# Altium project ForceVerkada.PrjPcb
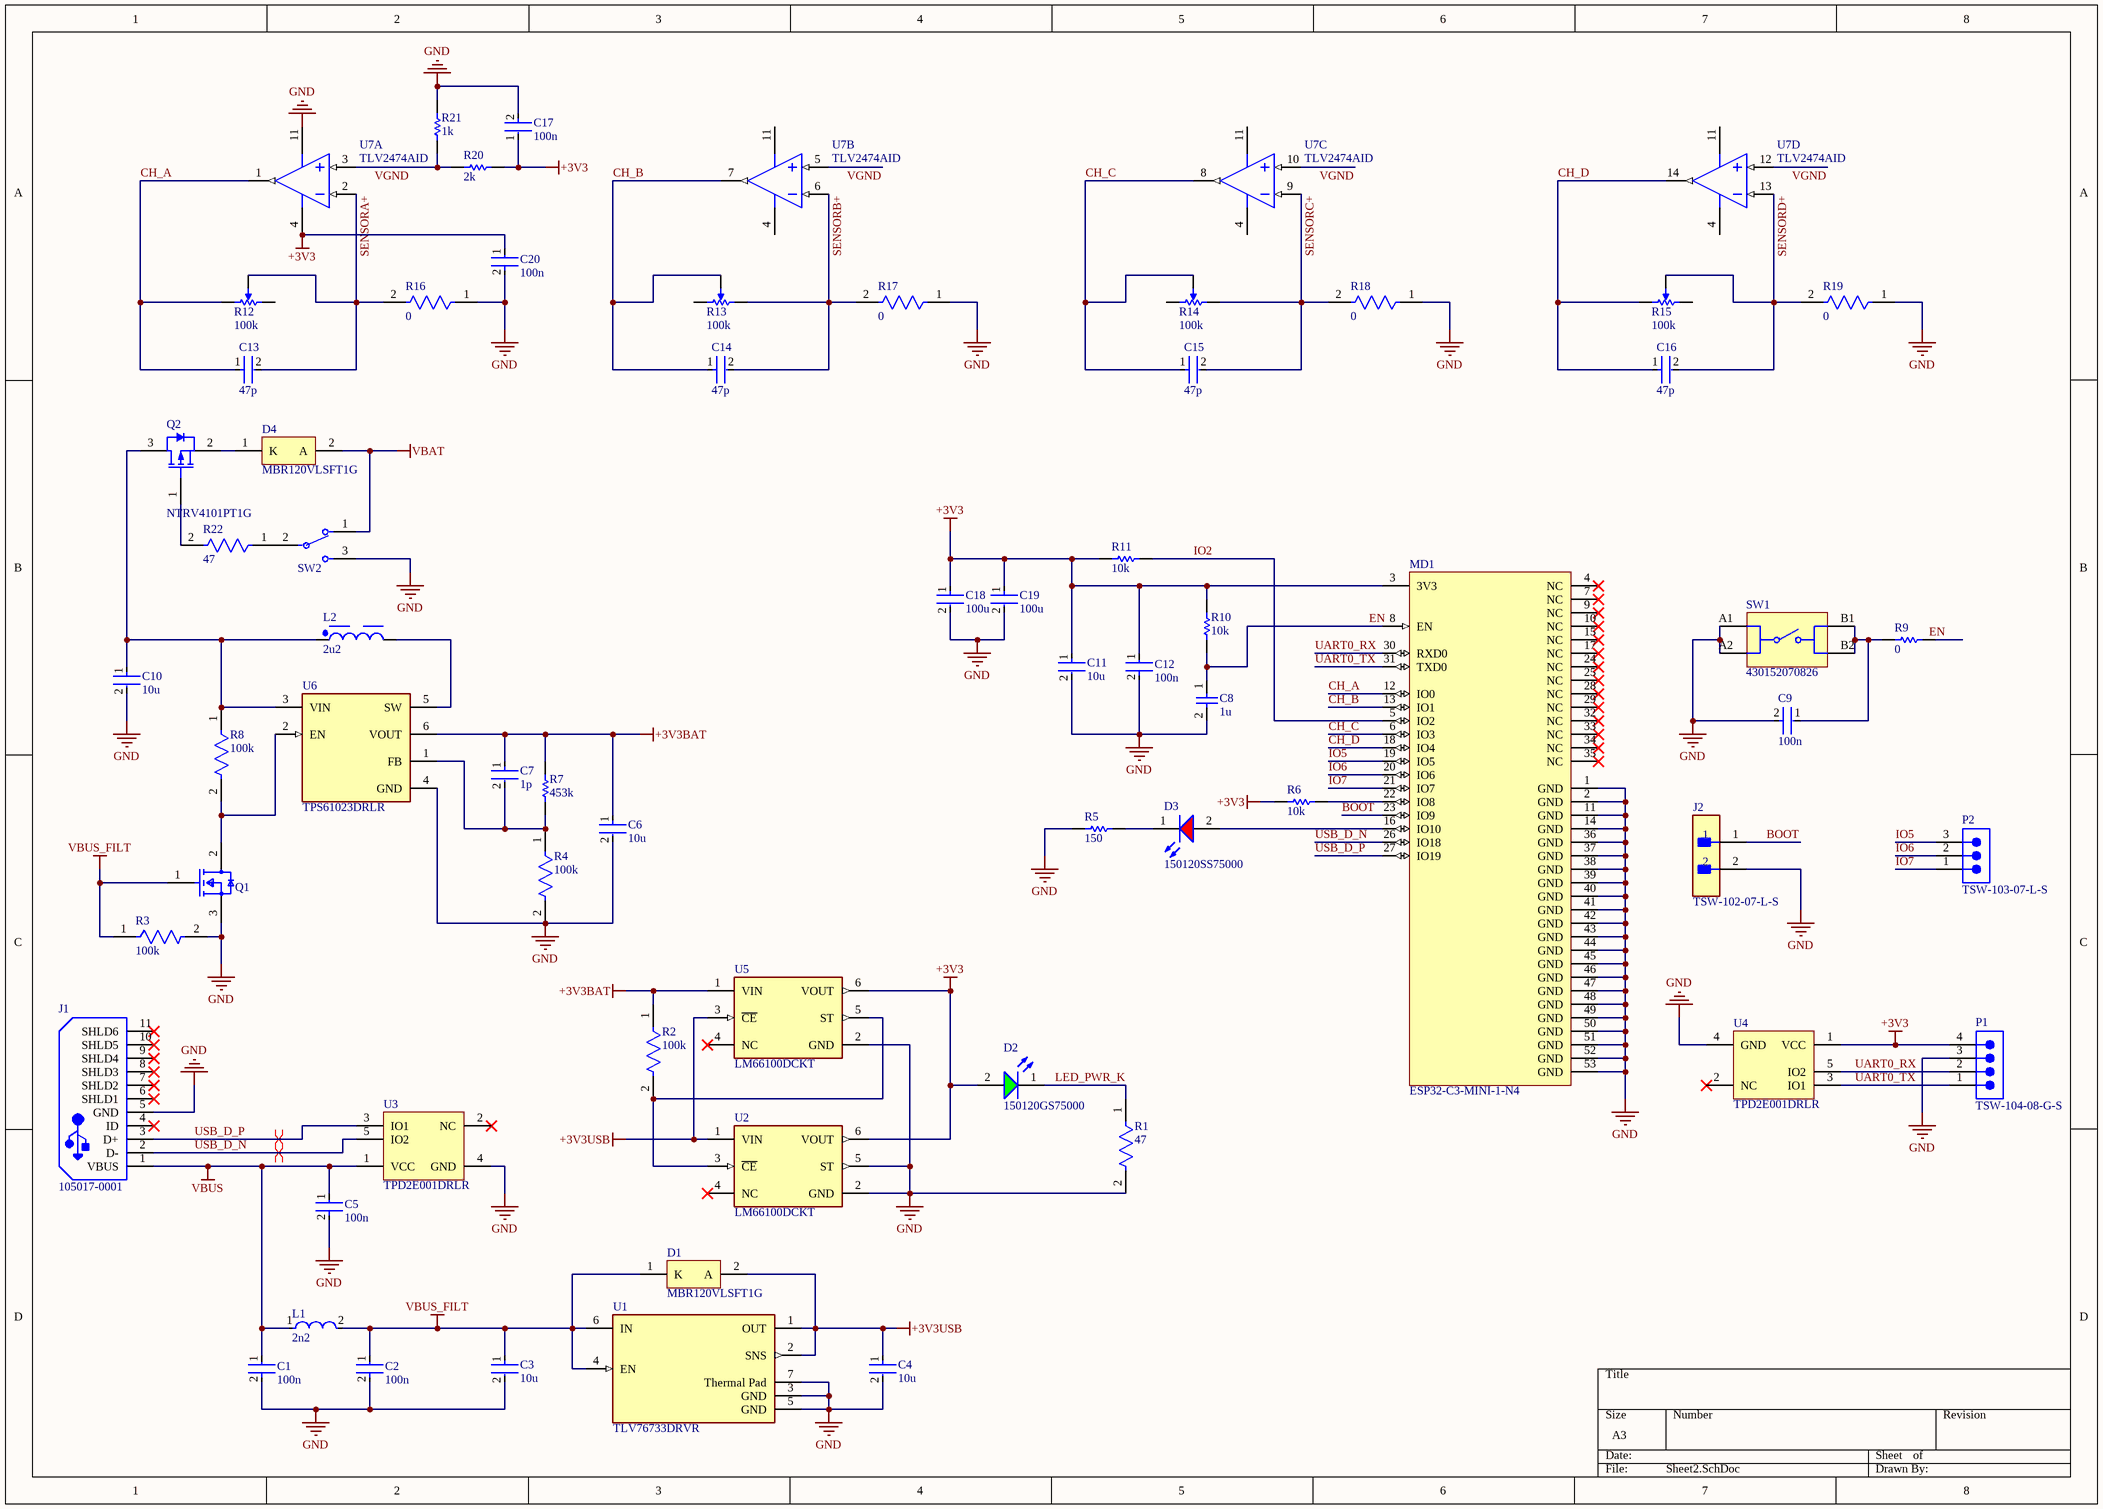
[diagram p0: Sheet2.SchDoc]
1 sheet, 64 parts. Net scope: global (net labels, ports and power ports of the same name join across sheets).
Board file: PCB2.PcbDoc

## Sheet Sheet2.SchDoc
size A3; SheetNumber: 1; SheetTotal: 1

### Parts
C1  100n  [FP-GRM15-MFG]
C2  100n  [FP-GRM15-MFG]
C3  10u  [FP-CL21-IPC_C]
C4  10u  [FP-CL21-IPC_C]
C5  100n  [FP-GRM15-MFG]
C6  10u  [FP-CL21-IPC_C]
C7  1p  [FP-GJM155-0_05-IPC_B]
C8  1u  [CAPC2013X135X45LL10T25]
C9  100n  [FP-GRM15-MFG]
C10  10u  [FP-GRM21B-0_1-IPC_C]
C11  10u  [FP-GRM21B-0_1-IPC_C]
C12  100n  [FP-GRM15-MFG]
C13  47p  [FP-C0805C-DN-MFG]
C14  47p  [FP-C0805C-DN-MFG]
C15  47p  [FP-C0805C-DN-MFG]
C16  47p  [FP-C0805C-DN-MFG]
C17  100n  [FP-GRM15-MFG]
C18  100u  [FP-CL32-IPC_C]
C19  100u  [FP-CL32-IPC_C]
C20  100n  [FP-GRM15-MFG]
D1  MBR120VLSFT1G  [ONSC-SOD-123FL-2-498-01_V]
D2  150120GS75000  [WL-SMCW_1206_150120xx75000]
D3  150120SS75000  [WL-SMCW_1206_150120xx75000]
D4  MBR120VLSFT1G  [ONSC-SOD-123FL-2-498-01_V]
J1  105017-0001  [USB-MICRO-B_V]
J2  TSW-102-07-L-S  [FP-TSW-102-07-L-S-MFG]
L1  2n2  [FP-LQW15AN_80-MFG]
L2  2u2  [WE-PD_7332R]
MD1  ESP32-C3-MINI-1-N4  [FP-ESP32-C3-MINI-1-N4-MFG]
P1  TSW-104-08-G-S  [SMTC-TSW-104-08-X-S]
P2  TSW-103-07-L-S  [SMTC-TSW-103-07-X-S]
Q1  FDN337N  [FP-527AG-MFG]  (value not drawn)
Q2  NTRV4101PT1G  [ONSC-SOT-23-3-318-08_V]
R1  47  [FP-RC0603-0_55-MFG]
R2  100k  [FP-RC0805-0_6-IPC_C]
R3  100k  [FP-RC0805-0_6-IPC_C]
R4  100k  [FP-RC0805-0_6-IPC_C]
R5  150  [RESC1608X55X25ML10T15]
R6  10k  [RESC2013X60X35NL10T20]
R7  453k  [RESC2013X60X35NL10T20]
R8  100k  [FP-RC0805-0_6-IPC_C]
R9  0  [RESC2013X60X35ML10T20]
R10  10k  [RESC2013X60X35NL10T20]
R11  10k  [RESC2013X60X35NL10T20]
R12  100k  [BOUR-3214W_V]
R13  100k  [BOUR-3214W_V]
R14  100k  [BOUR-3214W_V]
R15  100k  [BOUR-3214W_V]
R16  0  [FP-RC2512-0_65-IPC_C]
R17  0  [FP-RC2512-0_65-IPC_C]
R18  0  [FP-RC2512-0_65-IPC_C]
R19  0  [FP-RC2512-0_65-IPC_C]
R20  2k  [RESC2013X60X35ML10T20]
R21  1k  [RESC2013X60X35ML10T20]
R22  47  [FP-RC0603-0_55-MFG]
SW1  430152070826  [430152070826]
SW2  JS102011SAQN  [FP-JS102011SAQN-MFG]  (value not drawn)
U1  TLV76733DRVR  [FP-DRV0006A-IPC_C]
U2  LM66100DCKT  [FP-DCK0006A-IPC_C]
U3  TPD2E001DRLR  [DRL0005A_L]
U4  TPD2E001DRLR  [DRL0005A_L]
U5  LM66100DCKT  [FP-DCK0006A-IPC_C]
U6  TPS61023DRLR  [FP-DRL0006A-MFG]
U7  TLV2474AID  [D0014A_N]  (parts A,B,C,D of 4)

### Nets
+3V3: C11.1 C12.1 C17.1 C18.1 C19.1 C20.1 D2.2(A) MD1.3(3V3) P1.4 R6.1 R10.2 R11.1 R20.2 U2.6(VOUT) U4.1(VCC) U5.6(VOUT) U7.4(VDD)
+3V3BAT: C6.1 C7.1 R2.1 R7.2 U5.1(VIN) U6.6(VOUT)
+3V3USB: C4.1 D1.2(A) U1.1(OUT) U1.2(SNS) U2.1(VIN) U5.3(~{CE})
GND: C1.2 C2.2 C3.2 C4.2 C5.2 C6.2 C8.2 C9.2 C10.2 C11.2 C12.2 C17.2 C18.2 C19.2 C20.2 J1.5(GND) J2.2 MD1.1(GND) MD1.2(GND) MD1.11(GND) MD1.14(GND) MD1.36(GND) MD1.37(GND) MD1.38(GND) MD1.39(GND) MD1.40(GND) MD1.41(GND) MD1.42(GND) MD1.43(GND) MD1.44(GND) MD1.45(GND) MD1.46(GND) MD1.47(GND) MD1.48(GND) MD1.49(GND) MD1.50(GND) MD1.51(GND) MD1.52(GND) MD1.53(GND) P1.3 Q1.3(S) R1.2 R3.2 R4.2 R5.1 R16.1 R17.1 R18.1 R19.1 R21.2 SW1.A1 SW1.A2 SW2.3 U1.3(GND) U1.5(GND) U1.7(Thermal_Pad) U2.2(GND) U2.5(ST) U3.4(GND) U4.4(GND) U5.2(GND) U6.4(GND) U7.11(GND)
VBAT: D4.2(A) SW2.1
VBUS: C1.1 C5.1 J1.1(VBUS) L1.1 U3.1(VCC)
VBUS_FILT: C2.1 C3.1 D1.1(K) L1.2 Q1.1(G) R3.1 U1.4(EN) U1.6(IN)
BOOT: J2.1 MD1.23(IO9)
CH_A: C13.1 MD1.12(IO0) R12.3 U7.1(OUT1)
CH_B: C14.1 MD1.13(IO1) R13.2 U7.7(OUT2)
CH_C: C15.1 MD1.6(IO3) R14.2 U7.8(OUT3)
CH_D: C16.1 MD1.18(IO4) R15.3 U7.14(OUT4)
EN: C8.1 MD1.8(EN) R9.2 R10.1
IO2: MD1.5(IO2) R11.2
IO5: MD1.19(IO5) P2.3
IO6: MD1.20(IO6) P2.2
IO7: MD1.21(IO7) P2.1
LED_PWR_K: D2.1(K) R1.1
SENSORA+: C13.2 R12.2 R16.2 U7.2(IN1-)
SENSORB+: C14.2 R13.1 R17.2 U7.6(IN2-)
SENSORC+: C15.2 R14.1 R18.2 U7.9(IN3-)
SENSORD+: C16.2 R15.2 R19.2 U7.13(IN4-)
UART0_RX: MD1.30(RXD0) P1.2 U4.5(IO2)
UART0_TX: MD1.31(TXD0) P1.1 U4.3(IO1)
USB_D_N: J1.2(D-) MD1.26(IO18) U3.5(IO2)
USB_D_P: J1.3(D+) MD1.27(IO19) U3.3(IO1)
VGND: R20.1 R21.1 U7.3(IN1+) U7.5(IN2+) U7.10(IN3+) U7.12(IN4+)
NetC7_2: C7.2 R4.1 R7.1 U6.1(FB)
NetC9_1: C9.1 R9.1 SW1.B1 SW1.B2
NetC10_1: C10.1 L2.1 Q2.3(D) R8.1 U6.3(VIN)
NetD3_1: D3.1(K) R5.2
NetD3_2: D3.2(A) MD1.16(IO10)
NetD4_1: D4.1(K) Q2.2(S)
NetL2_2: L2.2 U6.5(SW)
NetMD1_22: MD1.22(IO8) R6.2
NetQ1_2: Q1.2(D) R8.2 U6.2(EN)
NetQ2_1: Q2.1(G) R22.2
NetR2_2: R2.2 U2.3(~{CE}) U5.5(ST)
NetR22_1: R22.1 SW2.2(C)

Not connected (* = marked no-connect by the designer): J1 4(ID)* 6(SHLD1)* 7(SHLD2)* 8(SHLD3)* 9(SHLD4)* 10(SHLD5)* 11(SHLD6)*; MD1 4(NC)* 7(NC)* 9(NC)* 10(NC)* 15(NC)* 17(NC)* 24(NC)* 25(NC)* 28(NC)* 29(NC)* 32(NC)* 33(NC)* 34(NC)* 35(NC)*; R12 1; R13 3; R14 3; R15 1; U2 4(NC)*; U3 2(NC)*; U4 2(NC)*; U5 4(NC)*

### Layout directives
differential pair: USB_D_N, USB_D_P

### Library data of the parts
C1 C2 C5 C9 C12 C17 C20 = CMP-2100-03641-2: CAP CER 0.1UF 16V X7R 0402; Manufacturer Part Number: GRM155R71C104KA88D; Manufacturer: Murata; Standoff Height: 0mm; Tolerance: 10%; Voltage Rating: 16Vdc; Material: Ceramic; Capacitance: 0.10μF; Value: 0.10μF; RoHS: TRUE; Temperature Characteristic: X7R; Octopart: https://octopart.com/grm155r71c104ka88d-murata-196880; Digikey Description: CAP CER 0.1UF 16V X7R 0402; Device Class L3: Ceramic Capacitors; Height: 0.55mm; ComponentLink2Description: Datasheet; Temperature Range Low: -55°C; Ipc Land Pattern Name: CAPC10050X219; ComponentLink2URL: https://search.murata.co.jp/Ceramy/image/img/A01X/G101/ENG/GRM155R71H471KA01-01A.pdf; Device Class L1: Passive Components; Lead Free: yes; Category: Cap; Package: GRM15; Temperature: -55°C to +125°C; Device Class L2: Capacitors; Temperature Range High: +125°C; Mouser Description: 0402 0.1 uF 16V ±10 % Tolerance X7R SMT Multilayer Ceramic Capacitor
C3 C4 C6 = CMP-13271-002245-1: CL21 Series 0805 10uF 10V ±20% Tolerance X5R Multilayer Ceramic Chip Capacitor; Voltage Rating (DC): 10V; Mount: Surface Mount; Tolerance: 20%; Case/Package: 0805; Voltage Rating: 10V; Dielectric: X5R; Max Operating Temperature: 85°C; Packaging: Tape and Reel; Capacitance: 10uF; Height: 1.25mm; Thickness: 0.053inch; Width: 0.049inch; Length: 2mm; Radiation Hardening: No; Min Operating Temperature: -55°C; Depth: 1.25mm; Package Quantity: 10000
C7 = CMP-2008-03808-2: Multi-Layer Ceramic Capacitor 1pF C0G  ±0.1pF 0402 Paper T/R; Temperature Coefficient: 30ppm/°C; Voltage Rating (DC): 50V; REACH SVHC: No SVHC; Packaging: Tape and Reel; Width: 0.02inch; Package Quantity: 10000; Min Operating Temperature: -55°C; Case Code (Imperial): 0402; Lead Pitch: 0.3mm; Capacitance: 1pF; Length: 1mm; Max Operating Temperature: 125°C; Depth: 0.5mm; Thickness: 0.022inch; Case Code (Metric): 1005; Lead Free: Lead Free; Voltage: 50V; Mount: Surface Mount; Number of Pins: 2; Termination: SMD/SMT; Radiation Hardening: No; Dielectric: C0G; Case/Package: 0402; Voltage Rating: 50V; Height: 0.5mm
C8 = CMP-2007-03460-1: Manufacturer: Murata; Part Number: GRM21BR71C105KA01K
C10 C11 = CMP-2007-03453-2: Chip Multilayer Ceramic Capacitors for General Purpose, 0805, 10uF, X5R, 15%, 10%, 16V; Radiation Hardening: No; Thickness: 0.053inch; Voltage Rating (DC): 16V; Lead Free: Lead Free; Package Quantity: 1; Width: 1.25mm; Case Code (Imperial): 0805; Depth: 1.25mm; Packaging: Tape and Reel; Dielectric: X5R; Max Operating Temperature: 85°C; Tolerance: 10%; Voltage Rating: 16V; Voltage: 16V; Capacitance: 10uF; Height: 1.25mm; Case Code (Metric): 2012; Material: Ceramic; Mount: Surface Mount; Case/Package: 0805; REACH SVHC: No SVHC; Length: 2mm; Min Operating Temperature: -55°C; Termination: SMD/SMT
C13-C16 = CMP-2007-00435-2: CAP CER 47PF 50V C0G/NP0 0805; Manufacturer: KEMET; Manufacturer Part Number: C0805C470J5GACTU; Temperature Characteristic: C0G; Material: Ceramic; Temperature Coefficient: 30ppm/°C; Tolerance: 0.05; Temperature Range High: +125°C; Device Class L1: Passive Components; Device Class L3: Ceramic Capacitors; Lead Free: Yes; Temperature: -55°C to +125°C; Capacitance: 47 pF; Height: 0.88mm; Octopart: https://octopart.com/c0805c470j5gactu-kemet-150274; RoHS: TRUE; Category: Cap; Voltage Rating: 50 V; Automotive: No; Device Class L2: Capacitors; Value: 47 pF; Ipc Land Pattern Name: CAPC200125X78; Temperature Range Low: -55°C; Mouser Description: Multilayer Ceramic Capacitors MLCC - SMD/SMT 50volts 47pF C0G 5%; Package: C0805C-DN; Digikey Description: CAP CER 47PF 50V C0G/NP0 0805; ComponentLink2URL: https://content.kemet.com/datasheets/KEM_C1003_C0G_SMD.pdf; ComponentLink2Description: Datasheet
C18 C19 = CMP-13271-001285-1: Cap Ceramic 100uF 10V X5R ±20% SMD 1210 +85°C Embossed T/R; Dielectric: X5R; Depth: 2.5mm; Width: 0.098inch; Voltage: 10V; Length: 3.2mm; Capacitance: 100uF; Radiation Hardening: No; Min Operating Temperature: -55°C; Thickness: 0.11inch; Mount: Surface Mount; Case Code (Imperial): 1210; Material: Ceramic; Tolerance: 20%; Contact Plating: Tin; Max Operating Temperature: 85°C; Voltage Rating: 10V; Lead Free: Lead Free; Case Code (Metric): 3225; Height: 2.5mm; Case/Package: 1210; Packaging: Tape and Reel; Voltage Rating (DC): 10V
D1 D4 = CMP-1055-00449-1: Schottky Power Rectifier, 2-Pin SOD-123, Pb-Free, Tape and Reel; Manufacturer: On Semiconductor; IFSM Max (A): 45; Configuration: Single; PackageDescription: 2-Pin SOD, Body 1.65 x 2.7 mm; RoHS: TRUE; ComponentLink2URL: http://www.onsemi.cn/pub_link/Collateral/MBR120VLSFT1-D.PDF; Mounting Technology: Surface Mount; ComponentLink1Description: Manufacturer URL; DatasheetVersion: Rev. 2; ComponentLink3Description: Package Specification; Packing: Tape and Reel; ComponentLink2Description: Datasheet; ComponentLink1URL: http://www.onsemi.com/; PackageVersion: Rev. A; PackageReference: SOD-123FL-2-498-01; ComponentLink3URL: http://www.onsemi.cn/pub_link/Collateral/MBR120VLSFT1-D.PDF; PartNumber: MBR120VLSFT1G
D2 = CMP-1426-00014-4: WL-SMCW SMT Mono-Color Chip LED Waterclear; Dominant Wavelength: 525nm; Reverse Voltage: 5V; Max Junction Temperature (Tj): 95°C; Lens Style: Clear, Rectangular; Forward Voltage: 3.2V; Power Dissipation: 105mW; Peak Wavelength: 515nm; Test Current: 20mA; Color: Green; Forward Current: 100mA; Luminous Intensity: 450mcd; Viewing Angle: 140°; Case Code (Imperial): 1206; REACH SVHC: Unknown; Packaging: Tape and Reel; Max Operating Temperature: 85°C; Case/Package: 1206; Height: 680µm; Length: 3.2mm; Mount: Surface Mount; Min Operating Temperature: -40°C; Width: 1.6mm; Case Code (Metric): 3216; Max Reverse Voltage (DC): 5V; RoHS: Compliant; Wavelength: 525nm
D3 = CMP-1426-00017-3: Led, Red, 630 Nm, 1.9 V, 30 Ma, 60 Mcd Rohs Compliant: Yes; Forward Current: 100mA; Max Reverse Voltage (DC): 5V; Lens Style: Clear, Rectangular; Viewing Angle: 140°; Luminous Intensity: 60mcd; Peak Wavelength: 645nm; Forward Voltage: 1.9V; Test Current: 20mA; Dominant Wavelength: 630nm; Case Code (Imperial): 1206; Length: 3.2mm; Mount: Surface Mount; Case Code (Metric): 3216; Case/Package: 1206; Min Operating Temperature: -40°C; Width: 1.6mm; Color: Red; Height: 680µm; REACH SVHC: Unknown; Max Operating Temperature: 85°C; Wavelength: 630nm; RoHS: Compliant; Packaging: Tape and Reel
J1 = CMP-2000-05827-1: Micro-USB B Receptacle, Right Angle, Bottom Mount, Surface Mount, with Solder Tabs, -30 to 85 degC, 5-Pin USB, RoHS, Tape and Reel; Manufacturer: Molex; Featured Product: Micro-USBConnectorsUSBConnectors; Other Names: WM1399DKR; Package Version: Rev. F, 12/2012; Number of Contacts: 5; Connector Type: USB-microB; Catalog Drawings: 1050170001; 3D Model: 105017-0001.stp; Mating Products: WM17145-ND-CABLEMICROUSBBTOSTDA1.0MWM17147-ND-CABLEMICROUSBBTOSTDA2.0MWM17146-ND-CABLEMICROUSBBTOSTDA1.5M; PCN Assembly/Origin: ResinSupplier21/Oct/2015; Voltage - Max: 30V; Online Catalog: Molex-MicroUSB; Manufacturer URL: http://www.molex.com/; Package Description: 5-Leads USB, Micro B, Body 7.5 x 5 mm, Pitch 0.65 mm; Datasheet URL: http://www.molex.com/elqNow/elqRedir.htm?ref=http://www.molex.com/webdocs/datasheets/pdf/en-us/1050170001_IO_CONNECTORS.pdf; Ingress Protection: -; Datasheet Version: 03/2016; Mounting Type: BoardCutout,SurfaceMount,RightAngle; Circuits: 5; Standard Package: 1; Package Reference: MICRO-B; Package URL: http://www.molex.com/pdm_docs/sd/1050170001_sd.pdf; Category: Connectors,Interconnects; Series: -; RoHS Information: 1050170001CertofCompliance; Features: Shielded,SolderRetention; Family: USB,DVI,HDMIConnectors; Specifications: -; Gender: Receptacle; Packaging: Digi-Reel®; Mounting Technology: SurfaceMount
J2 = CMP-02766-001428-1: CONN HEADER VERT 2POS 2.54MM; Voltage Rating: 550V; Current Rating: 7.6A; Gender: Male; Number of Contacts: 2; Connector Type: Male Pin; Radiation Hardening: No; Orientation: Straight; Contact Plating: Gold; Max Operating Temperature: 125°C; Mount: Through Hole; Package Quantity: 1; Number of Rows: 1; Housing Material: Polyester; RoHS Compliant: Yes; Length: 5.08mm; Max Voltage Rating (AC): 550V; Pitch: 2.54mm; Packaging: Bulk; Depth: 2.54mm; Termination: Solder; Min Operating Temperature: -55°C; Housing Color: Black; Lead Free: Lead Free; Color: Black; Number of Positions: 2; Width: 2.54mm; Max Current Rating: 7.6A; REACH SVHC: No SVHC; Contact Material: Bronze; Contact Mating Length: 0.23inch; Series: TSW; Contact Type: Male Pin
L1 = CMP-06042-010718-1: Wire Wound RF Inductor 2.2nH ±0.1nH 2530mA 0.022Ω 0402 (1005); Current Rating: 2.53A; Self Resonant Frequency: 15.5GHz; Shielding: Unshielded; DC Resistance (DCR): 22mR; Core Material: Non-Magnetic; Q Factor: 30; Test Frequency: 100MHz; Case Code (Imperial): 0402; Length: 0.039inch; Resistor Type: Wirewound; Height: 0.5mm; Max Operating Temperature: 125°C; Width: 0.5mm; Inductance: 2.2nH; Case Code (Metric): 1005; Case/Package: 0402; Mount: Surface Mount; Termination: SMD/SMT; Packaging: Tape and Reel; Max DC Current: 2.53A; Height - Seated (Max): 0.024inch; Min Operating Temperature: -55°C; Package Quantity: 10000
L2 = CMP-1396-00043-2: NexarPartId: 8917183; Saturation Current: 4.8A; Tolerance: 20%; Inductance: 2.2µH; Self Resonant Frequency: 36MHz; Current Rating: 4.02A; Shielding: Shielded; DC Resistance (DCR): 20mΩ; Core Material: Ferrite; Resistance: 23mΩ; Test Frequency: 1kHz; Mount: Surface Mount; Termination: SMD/SMT; Number of Pins: 2; Case/Package: Nonstandard; Height: 3.2mm; Max Operating Temperature: 125°C; Ambient Temperature Range Low: -40°C; Min Operating Temperature: -40°C; Height - Seated (Max): 3.5052mm; REACH SVHC: Unknown; Weight: 4.535924g; Ambient Temperature Range High: 85°C; Max DC Current: 4.02A; Composition: Wirewound; RoHS: Compliant; Lead Pitch: 4mm; Inductance Tolerance: 20%; RMS Current (Irms): 4.02A; Series Resistance: 23mΩ; Length: 7.3mm; Width: 7.3mm; Packaging: Cut Tape (CT)
MD1 = CMP-10700-116589975-1: Multiprotocol Modules SMD module, ESP32-C3FN4, PCB antenna, -40 C +85 C; Max Frequency: 2.484GHz; Min Supply Voltage: 3V; Current - Transmitting: 350mA; Interface: SPI; Data Rate: 150Mbps; Max Supply Voltage: 3.6V; Number of GPIO: 13; Current - Receiving: 84mA; Min Operating Temperature: -40°C; Height: 2.55mm; Ambient Temperature Range High: 85°C; Max Operating Temperature: 85°C
P1 = CMP-1024-00357-1: 0.025" SQ Post Header, Through-hole, Vertical, -55 to 125 degC, 2.54 mm Pitch, 4-Pin, Male, RoHS; Manufacturer: Samtec; Pitch: 2.54 mm; RoHS: True; ComponentLink3URL: http://www.samtec.com/documents/webfiles/cpdf/TSW-XXX-XX-XXX-X-XX-XXX-MKT.pdf; Mounting Technology: Through-hole; ComponentLink2URL: http://www.samtec.com/documents/webfiles/pdf/TSW_TH.PDF; ComponentLink1URL: http://www.samtec.com; ComponentLink3Description: Package Specification; PackageVersion: DM, 8/1988; ComponentLink2Description: Datasheet; PackageReference: TSW-104-08-X-S; PackageDescription: .025[0.64] SQ. Post Terminal Strip Assembly; PartNumber: TSW-104-08-G-S; ComponentLink1Description: Manufacturer URL; Temperature Range: -55 to 125 degC; DatasheetVersion: F-214; Orientation: Vertical
P2 = CMP-1024-00334-1: 0.025" SQ Post Header, Through-hole, Vertical, -55 to 125 degC, 2.54 mm Pitch, 3-Pin, Male, RoHS; Manufacturer: Samtec; Pitch: 2.54 mm; Mounting Technology: Through-hole; ComponentLink2URL: http://www.samtec.com/documents/webfiles/pdf/TSW_TH.PDF; ComponentLink3Description: Package Specification; PackageVersion: DM, 8/1988; PartNumber: TSW-103-07-L-S; PackageReference: TSW-103-07-X-S; Orientation: Vertical; ComponentLink1URL: http://www.samtec.com; PackageDescription: .025[0.64] SQ. Post Terminal Strip Assembly; ComponentLink1Description: Manufacturer URL; ComponentLink2Description: Datasheet; ComponentLink3URL: http://www.samtec.com/documents/webfiles/cpdf/TSW-XXX-XX-XXX-X-XX-XXX-MKT.pdf; RoHS: True; DatasheetVersion: F-214; Temperature Range: -55 to 125 degC
Q1 = CMP-2000-06250-2: MOSFET N-CH 30V 2.2A SSOT3; Drain-source On Resistance-Max: 65mR; Threshold Voltage: 700mV; Element Configuration: Single; Fall Time: 4ns; Input Capacitance: 300pF; Polarity: N-CHANNEL; Rise Time: 10ns; Power Dissipation: 500mW; Gate to Source Voltage (Vgs): 8V; Turn-Off Delay Time: 17ns; Number of Elements: 1; Length: 2.92mm; Current Rating: 2.2A; Continuous Drain Current (ID): 2.2A; Weight: 0.03g; Packaging: Tape and Reel; Rds On Max: 65mR; Contact Plating: Tin; Drain to Source Breakdown Voltage: 30V; Min Operating Temperature: -55°C; Height: 0.94mm; Case/Package: TO-236-3; Series: -; On-State Resistance: 65mR; Termination: SMD/SMT; Lead Free: Lead Free; Mount: Surface Mount; Package Quantity: 1; Number of Pins: 3; Drain to Source Resistance: 65mR; Voltage Rating (DC): 30V; REACH SVHC: No SVHC; Max Operating Temperature: 150°C; Drain to Source Voltage (Vdss): 30V; RoHS Compliant: Yes; Nominal Vgs: 700mV; Turn-On Delay Time: 4ns; Dual Supply Voltage: 30V; Width: 3.05mm; Max Power Dissipation: 500mW
Q2 = CMP-1058-00744-1: Trench Power MOSFET, -20 V, Single P-Channel, 3-Pin SOT-23, Pb-Free, Tape and Reel; Manufacturer: On Semiconductor; Crss Typ (pF): 75; V(BR)DSS Min (V): 20; Coss Typ (pF): 100; Ciss Typ (pF): 675; VGS Max (V): 8; Channel Polarity: P Channel; ID Max (A): 3.2; VGS(th) Max (V): 1.2; Qrr Typ (nC): 1008; ComponentLink2URL: http://www.onsemi.cn/pub_link/Collateral/NTR4101P-D.PDF; PartNumber: NTRV4101PT1G; ComponentLink1Description: Manufacturer URL; Packing: Tape and Reel; ComponentLink1URL: http://www.onsemi.com/; PackageReference: SOT-23-3-318-08; ComponentLink3URL: http://www.onsemi.cn/pub_link/Collateral/318-08.PDF; PackageVersion: Rev. AP, 11/2009; Package Type: SOT-23-3; Configuration: Single; ComponentLink3Description: Package Specification; Mounting Technology: Surface Mount; RoHS: Pb-Free; ComponentLink2Description: Datasheet; PackageDescription: 3-Pin Small Outline Transistor, Body 2.92 x 1.3 mm, Pitch 0.95 mm; DatasheetVersion: Rev. 9
R1 R22 = CMP-1659-00039-2: NexarPartId: 40952917; Voltage Rating (AC): 50V; Temperature Coefficient: 100ppm/°C; Resistance: 47Ω; Power Rating: 100mW; Tolerance: 1%; Voltage Rating: 75V; Length: 1.6mm; Height: 450µm; Case/Package: 0603; Lead Free: Lead Free; Max Operating Temperature: 155°C; Voltage Rating (DC): 50V; Number of Pins: 2; RoHS: Compliant; Packaging: Tape & Reel; Mount: Surface Mount; Termination: SMD/SMT; Depth: 800µm; Case Code (Metric): 1608; Weight: 2.012816mg; Width: 800µm; Features: Moisture Resistant; Min Operating Temperature: -55°C; Schedule B: 8533210045, 8533210045; Max Power Dissipation: 100mW; Number of Terminations: 2; Case Code (Imperial): 0603; Military Standard: Not; Composition: Thick Film; REACH SVHC: No SVHC
R2-R4 R8 = CMP-2100-03668-5: RES 100K OHM 1% 1/8W 0805; Power Rating: 125mW; Temperature Coefficient: 100ppm/°C; Voltage Rating (DC): 150V; Resistance: 100kR; Package Quantity: 1; Case/Package: 0805; Lead Pitch: 0.4mm; Case Code (Imperial): 0805; Construction: Rectangular; Number of Terminations: 2; RoHS Compliant: Yes; Max Power Dissipation: 125mW; Tolerance: 1%; Max Operating Temperature: 155°C; Resistance Tolerance: 1%; Lead Free: Lead Free; Packaging: Tape and Reel; Resistor Type: Thick Film; Min Operating Temperature: -55°C; Case Code (Metric): 2012; Series: RC; Technology: THICK FILM; Voltage Rating: 150V; Termination: SMD/SMT; Width: 0.049inch; Number of Pins: 2; Features: Moisture Resistant; Military Standard: Not; Length: 0.079inch; Depth: 1.25mm; Size Code: 0805; Height: 0.024inch
R5 = CMP-1659-00057-1: Chip Resistor, 150 Ohm, +/- 1%, 0.1 W, -55 to 155 degC, 0603 (1608 Metric), RoHS, Tape and Reel; Viewing Angle: 20 degrees; Luminous Intensity: 200 mcd; Case\Package: Radial; Lens Style: Clear; Nominal Vf: 2.2 V; Illumination Colour: Green; PackageReference: 0603; PackageDescription: 2-Pin Surface Mount Device, Body 1.6 x 0.8 mm; Package Quantity: 1000; Packaging: Bulk; DatasheetVersion: Rev. 4, 02/2016; ComponentLink2URL: http://www.yageo.com/documents/recent/PYu-RC_Group_51_RoHS_L_04.pdf; ComponentLink1Description: Manufacturer URL; Height: 8.6 mm; ComponentLink2Description: Datasheet; Mount: Through Hole; Colour: Green; RoHSCompliant: true; ComponentLink1URL: http://www.yageo.com/; Forward Voltage: 2.2 V
R6 R10 R11 = CMP-1659-00013-4: Chip Resistor, 10 KOhm, +/- 1%, 0.125 W, -55 to 155 degC, 0805 (2012 Metric), RoHS, Tape and Reel; Manufacturer: Yageo; Voltage Rating: 150 V; Mount: Surface Mount; ComponentLink1Description: Manufacturer URL; ComponentLink2URL: http://www.yageo.com/documents/recent/PYu-RC_Group_51_RoHS_L_04.pdf; Pins: 2; Length: 2 mm; Min Operating Temperature: -55 degC; Height: 0.5 mm; Mounting Technology: Surface Mount; RoHSCompliant: true; REACH SVHC: No SVHC; ComponentLink1URL: http://www.yageo.com/; Max Operating Temperature: 155 degC; PackageReference: 0805; DatasheetVersion: Rev. 4, 02/2016; Package Quantity: 5000; Packaging: Tape and Reel; ComponentLink2Description: Datasheet; PackageDescription: 2-Pin Surface Mounted Device, Body 2 x 1.25 mm
R7 = CMP-2001-01154-1: Part Number: RC0805FR-07453KL; Manufacturer: Yageo
R9 = CMP-2100-03673-1: Chip Resistor, 0 Ohm, Jumper, +/- 5%, 0.125 W, -55 to 155 degC, 0805 (2012 Metric), RoHS, Tape and Reel; Manufacturer: Yageo; Power Rating: 125mW; Resistance: 0mOhm; Voltage Rating (DC): 150V; Temperature Coefficient: 200ppm/degreesC; Height: 0.5mm; Depth: 1.25mm; Case Code (Imperial): 0805; Lead Free: LeadFree; Military Standard: Not; Package Description: 2-Pin Surface Mounted Device, Body 2 x 1.25 mm; Case Code (Metric): 2012; Composition: ThickFilm; Voltage Rating: 150V; Manufacturer URL: http://www.yageo.com/; Packaging: TapeandReel; Package Reference: 0805; REACH SVHC: Unknown; Tolerance: 5%; Case/Package: 0805; Max Operating Temperature: 155degC; Number of Pins: 2; Min Operating Temperature: -55degC; RoHSCompliant: true; Length: 2mm; Datasheet URL: http://www.yageo.com/NewPortal/yageodocoutput?fileName=/pdf/R-Chip/PYu-RC_Group_51_RoHS_L_5.pdf; Termination: SMD/SMT; Radiation Hardening: No; Width: 1.25mm; Contact Plating: Tin; Datasheet Version: Rev. 5, 10/2016
R12-R15 = CMP-2000-05578-1: 3214 - 5-Turn Trimpot(R) Trimming Potentiometer, 100 KOhm, +/- 10%, 0.25 W, -65 to 150 degC, RoHS, Tape and Reel; Manufacturer: Bourns; Temperature Coefficient: ±100ppm/°C; No. of Turns: 5; Potentiometer Mounting: SMD; Power Rating: 250mW; SVHC: NoSVHC(16-Jun-2014); Datasheet URL: http://www.bourns.com/docs/Product-Datasheets/3214.pdf; Mounting Technology: SurfaceMount; Datasheet Version: 05/2016; Manufacturer URL: http://www.bourns.com/; Package Description: 3-Pin Surface Mount Device, Body 3.5 x 4.8 mm, Pitch 1.25 mm; RoHS Compliant: Yes; Package Reference: 3214W; Track Resistance: 100kohm; Resistance Tolerance: ±10%
R16-R19 = CMP-2000-06974-2: RES SMD 0 OHM JUMPER 1W 2512; Tolerance: 5%; Voltage Rating: 200V; Resistance: 0mR; Temperature Coefficient: 200ppm/°C; Contact Plating: Tin; Min Operating Temperature: -55°C; Resistor Type: Thick Film; Length: 0.25inch; RoHS Compliant: Yes; Package Quantity: 4000; Max Power Dissipation: 1W; Resistance Tolerance: 5%; Series: RC; Case/Package: 2512; Case Code (Imperial): 2512; Size Code: 2512; Case Code (Metric): 6432; Max Operating Temperature: 155°C; Termination: SMD/SMT; Height: 0.026inch; Radiation Hardening: No; Packaging: Tape and Reel; Power Rating: 1W; Width: 3.1mm; Lead Free: Lead Free; Features: Moisture Resistant; Number of Terminations: 2
R20 = CMP-2001-01361-1: Manufacturer: Yageo; Part Number: RC0805JR-072KL
R21 = CMP-2100-03671-1: Chip Resistor, 1 KOhm, +/- 1%, 125 mW, -55 to 155 degC, 0805 (2012 Metric), RoHS, Tape and Reel; Manufacturer: Yageo; Temperature Coefficient: 100ppm/degreesC; Voltage Rating (DC): 150V; Max Power Dissipation: 125mW; Resistance: 1KOhm; Number of Pins: 2; Number of Terminations: 2; Datasheet URL: http://www.yageo.com/NewPortal/yageodocoutput?fileName=/pdf/R-Chip/PYu-RC_Group_51_RoHS_L_5.pdf; Length: 0.079inch; Package Description: 2-Pin Surface Mounted Device, Body 2 x 1.25 mm; Depth: 1.25mm; Height: 0.024inch; Military Standard: Not; Case/Package: 0805; Package Reference: 0805; RoHSCompliant: true; Lead Free: LeadFree; Packaging: TapeandReel; Package Quantity: 1; Datasheet Version: Rev. 5, 10/2016; Tolerance: 1%; Min Operating Temperature: -55degC; Voltage Rating: 150V; Composition: ThickFilm; Case Code (Imperial): 0805; Power Rating: 125mW; Width: 0.049inch; Case Code (Metric): 2012; Manufacturer URL: http://www.yageo.com/; Max Operating Temperature: 155degC; REACH SVHC: Unknown; Termination: SMD/SMT
SW1 = CMP-1452-00005-4: Switch Tactile N.O. SPST Round Button Gull Wing 0.05A 12VDC 500000Cycles 2.55N SMD Reel; Voltage Rating (DC): 12V; Contact Resistance: 100mΩ; Contact Current Rating: 50mA; Life (Cycles): 200kcycles; Max Operating Temperature: 85°C; Mount: Surface Mount; Min Operating Temperature: -40°C; Voltage Rating: 12V; Packaging: Tape and Reel; Contact Plating: Silver; Insulation Resistance: 100MΩ; Color: White; Diameter: 3mm; Current Rating: 50mA; RoHS: Compliant; Height: 7mm
SW2 = CMP-2000-06501-2: SWITCH SLIDE SPDT 300MA 6V; Switch Function: On-On; Illumination Type: Non-Illuminated; Switch Travel: 2mm; Contact Resistance: 70mR; Actuator Material: Nylon; Electrical Life: 5000Cycles; Actuator Type: Standard; Max Operating Temperature: 85°C; Housing Material: Nylon; Radiation Hardening: No; Max Voltage Rating (DC): 6V; Package Quantity: 1; Case/Package: 100; Actuator Length: 2mm; Min Operating Temperature: -40°C; Contact Current Rating: 300mA; REACH SVHC: No SVHC; Throw Configuration: SPDT; Packaging: Tape and Reel; Contact Material: Copper Alloy; Max Current Rating: 300mA; Current Rating: 300mA; Mount: Surface Mount; Lead Free: Lead Free; Termination: Gull Wing; Voltage Rating (DC): 6V; Length: 9mm; Orientation: Right Angle; Contact Plating: Silver
U1 = CMP-04917-000203-1: VOLTAGE COMPARATOR
U2 U5 = CMP-04910-000059-1: IC OR CTRLR IDEAL DIODE SC70-6
U3 U4 = CMP-0326-00048-3: Low-Capacitance + / - 15 kV ESD-Protection Array for High-Speed Data Interfaces, 2 Channels, -40 to +85 degC, 5-pin SOT (DRL), Green (RoHS & no Sb/Br); Manufacturer: Texas Instruments; IO Leakage Current(nA): 1; IEC 61000-4-2 Air-Gap(+/- kV): 15; IEC 61000-4-2 Contact(+/- kV): 8; SubFamily: ESD Solution; IO Capacitance(Typ)(pF): 1.5; Breakdown Voltage(Min)(V): 11; USB High Speed: TRUE; ComponentLink3Description: URL Link1; PackageReference: DRL0005A; PartNumber: TPD2E001DRLR; PackageDescription: 5-Pin Plastic Small Outline, Flat Lead 0.5 mm Pitch; PackageVersion: revD, Aug-2007; DatasheetVersion: SLLS684F; ComponentLink1Description: Manufacturer URL; ComponentLink2Description: Datasheet; ComponentLink1URL: http://www.ti.com/; ComponentLink2URL: http://www.ti.com/general/docs/lit/getliterature.tsp?genericPartNumber=TPD2E001&fileType=pdf; ComponentLink3URL: SamplesURL:http://www.ti.com/product/tpd2e001#samples; Eco-Plan: Green (RoHS & no Sb/Br); Mounting Technology: Surface Mount
U6 = CMP-04918-000638-1: FINISH GOODS FOR TPS61023
U7 = CMP-0272-00062-3: Quad Low-Power Rail-to-Rail Input / Output Operational Amplifier, 2.7 to 6 V, -40 to 125 degC, 14-pin SOIC (D14), Green (RoHS & no Sb/Br); Manufacturer: Texas Instruments; Number of Channels: 4; IIB(Max)(pA): 50; Vio (25C)(Max)(mV): 1.6; Total Supply Voltage(Min)(+5V is 5, +/-5V is 10): 2.7; Slew Rate(Typ)(V/us): 1.4; Sub Family: Low Supply Voltage Amplifier (<=2.7V), Precision Amplifier; Offset Drift(Typ)(uV/C): 0.4; Total Supply Voltage(Max)(+5V is 5, +/-5V is 10): 6; Vn at 1kHz(Typ)(nV/rtHz): 15; CMRR(Min)(dB): 61; Iq per channel(Max)(mA): 0.75; ComponentLink1Description: Manufacturer URL; ComponentLink3Description: Package Specification; ComponentLink2Description: Datasheet; PackageReference: D0014A; DatasheetVersion: SLOS232E; Mounting Technology: Surface Mount; Eco-Plan: Green (RoHS & no Sb/Br); PartNumber: TLV2474AID; ComponentLink1URL: http://www.ti.com/; ComponentLink3URL: http://www.ti.com/lit/ml/mpds177g/mpds177g.pdf; PackageVersion: 4040047-5/M, 06/2011; ComponentLink2URL: http://www.ti.com/general/docs/lit/getliterature.tsp?genericPartNumber=TLV2474A&fileType=pdf; PackageDescription: 14-Pin Plastic Small Outline, Body 8.65 x 3.9 mm, Pitch 1.27 mm; Code_JEDEC: MS-012